# EAGLE design juggling_ballsch (EAGLE 6.5.0)
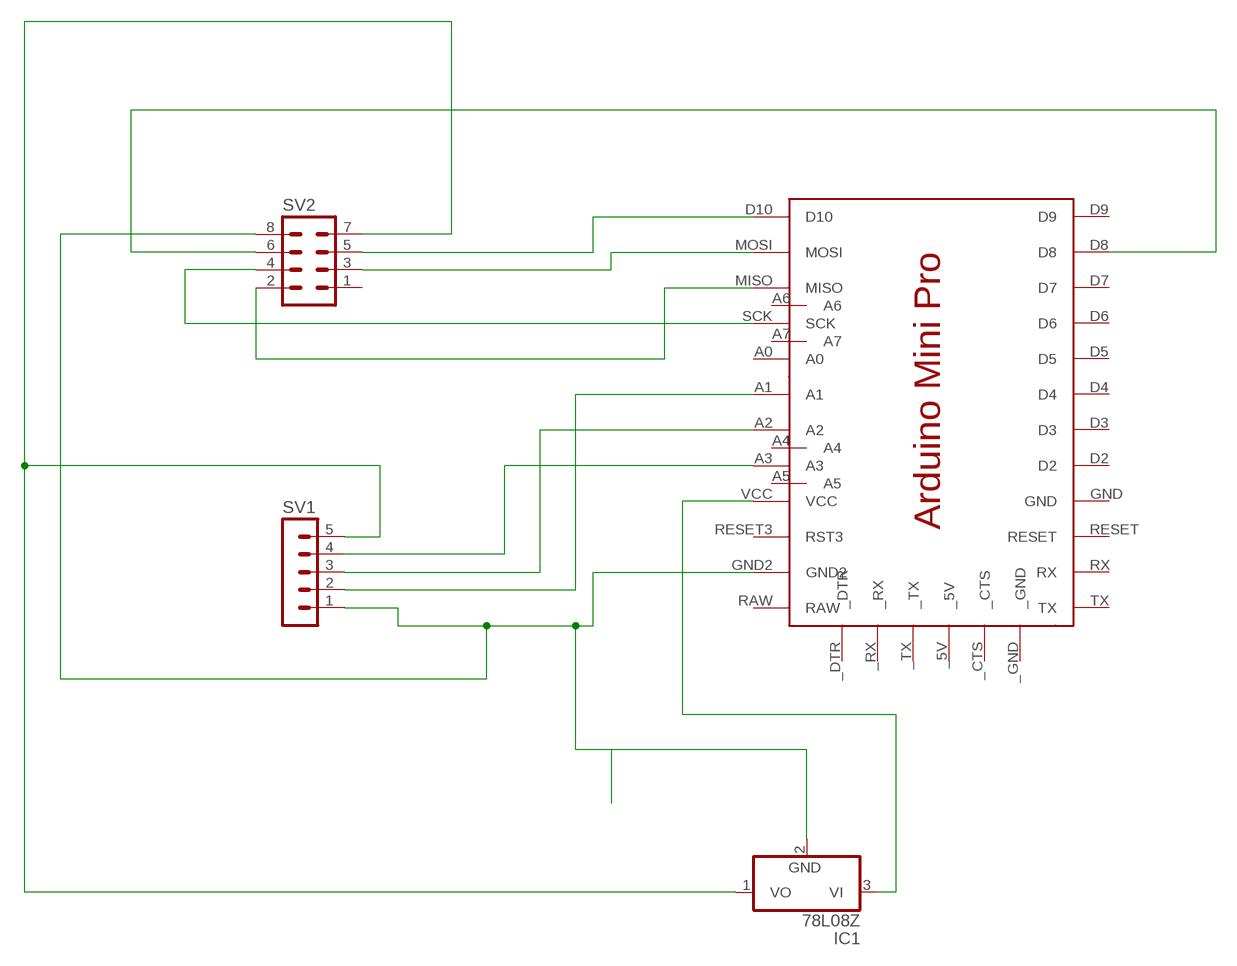
[diagram p0: schematic, sheet 1]

## Parts
IC1  78L08Z  [TO92]
SV1  MA05-1  [MA05-1]
SV2  MA04-2  [MA04-2]
U$1  ARDMINIPRO  [ARDMINIPRO]

## Nets
N$1: SV1.2 U$1.A1
N$2: SV1.3 U$1.A2
N$3: SV1.4 U$1.A3
N$4: IC1.2(GND) SV1.1 SV2.8 U$1.GND2
N$5: SV2.3 U$1.MOSI
N$6: SV2.5 U$1.D10
N$7: SV2.2 U$1.MISO
N$8: SV2.6 U$1.D8
N$9: SV2.4 U$1.SCK
N$11: IC1.1(VO) SV1.5 SV2.7
N$12: IC1.3(VI) U$1.VCC
Unconnected: SV2.1 U$1._5V U$1._CTS U$1._DTR U$1._GND U$1._RX U$1._TX U$1.A0 U$1.A4 U$1.A5 U$1.A6 U$1.A7 U$1.D2 U$1.D3 U$1.D4 U$1.D5 U$1.D6 U$1.D7 U$1.D9 U$1.GND U$1.RAW U$1.RESET U$1.RESET3(RST3) U$1.RX U$1.TX

## Library data of the parts
IC1 = adafruit:78*: Positive VOLTAGE REGULATOR Added bigger pads to the TO-92 package
SV1 = con-lstb:MA05-1: PIN HEADER; OC_FARNELL: unknown; OC_NEWARK: unknown
SV2 = con-lstb:MA04-2: PIN HEADER; OC_FARNELL: unknown; OC_NEWARK: unknown
U$1 = Charlie:ARDMINIPRO

## Board
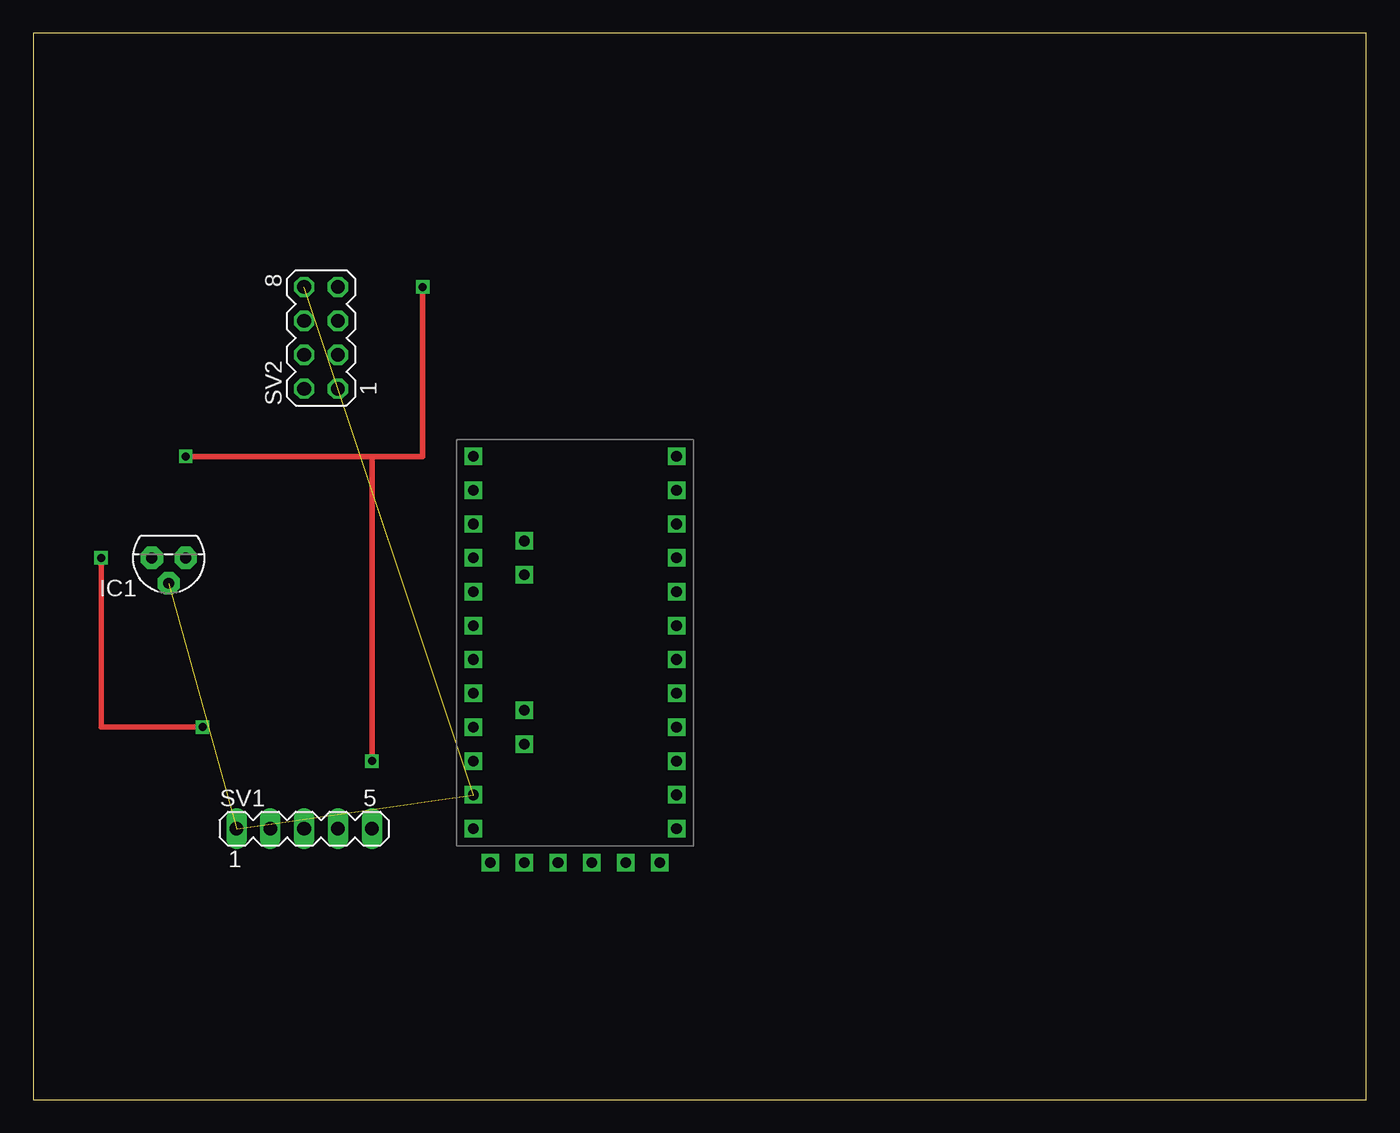
[diagram p1: board, top side]
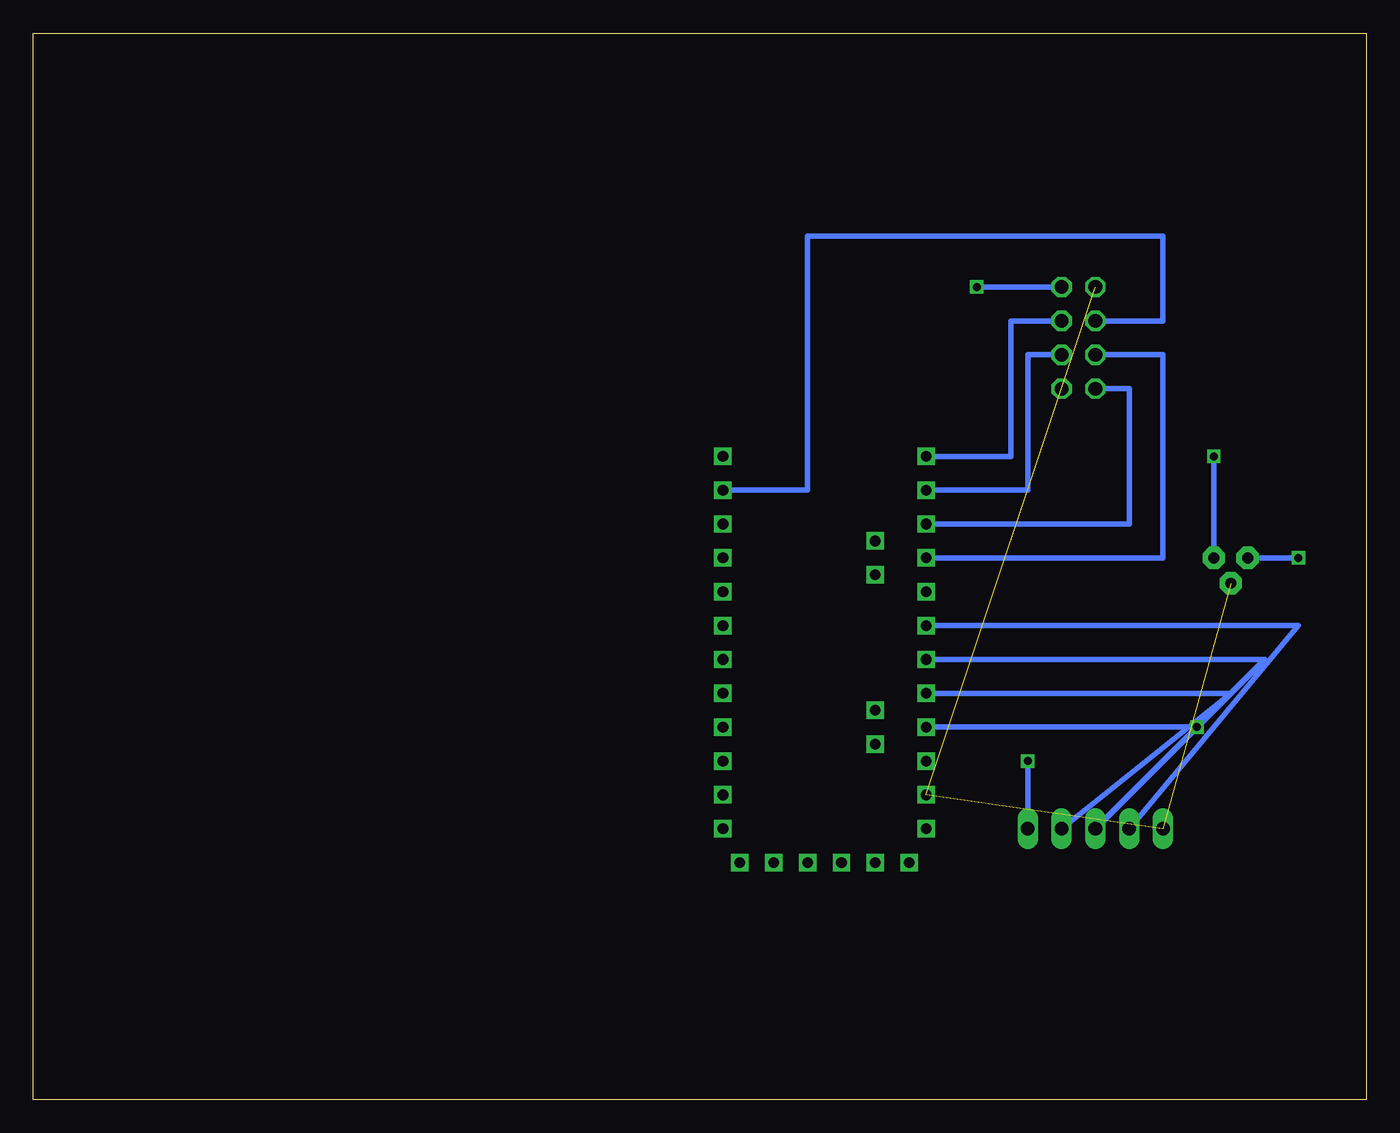
[diagram p2: board, bottom side, seen from below]

Size 100 x 80 mm. Coordinates in mm from the lower left corner, seen from the top.
Outline: 0,0 100,0 100,80 0,80 0,0
Copper layers (1*16): Top 0.035mm / dielectric 1.5mm / Bottom 0.035mm
Design rules "default": minimum track width 10mil, minimum drill 24mil, track to track 8mil, track to pad 8mil, pad to pad 8mil, via to via 8mil, smd to smd 8mil, copper to edge 40mil, drill to drill 8mil, minimum pad ring 10mil, minimum via ring 8mil, stop-mask expansion 4mil, vias tented up to drill 0mil, thermal gap 10mil

### Footprints (pad centres in the part's own frame; a part is rotated, then mirrored left to right if it is on the bottom)
TO92 = drill 0.813 pad 1.676 octagon: 1 -1.27,0; 2 0,1.905; 3 1.27,0
MA05-1 = drill 1.016 long: 1 -5.08,0; 2 -2.54,0; 3 0,0; 4 2.54,0; 5 5.08,0
MA04-2 = drill 1.016 octagon: 1 -3.81,-1.27; 2 -3.81,1.27; 3 -1.27,-1.27; 4 -1.27,1.27; 5 1.27,-1.27; 6 1.27,1.27; 7 3.81,-1.27; 8 3.81,1.27
ARDMINIPRO = drill 0.8 square: _5V -1.27,16.51; _CTS -3.81,16.51; _DTR 6.35,16.51; _GND -6.35,16.51; _RX 3.81,16.51; _TX 1.27,16.51; A0 7.62,-3.81; A1 7.62,-1.27; A2 7.62,1.27; A3 7.62,3.81; A4 3.81,5.08; A5 3.81,7.62; A6 3.81,-7.62; A7 3.81,-5.08; D2 -7.62,3.81; D3 -7.62,1.27; D4 -7.62,-1.27; D5 -7.62,-3.81; D6 -7.62,-6.35; D7 -7.62,-8.89; D8 -7.62,-11.43; D9 -7.62,-13.97; D10 7.62,-13.97; GND -7.62,6.35; GND2 7.62,11.43; MISO 7.62,-8.89; MOSI 7.62,-11.43; RAW 7.62,13.97; RESET -7.62,8.89; RESET3 7.62,8.89; RX -7.62,11.43; SCK 7.62,-6.35; TX -7.62,13.97; VCC 7.62,6.35

### Placement (x,y rotation side)
IC1  10.16,40.64 180 top
SV1  20.32,20.32 0 top
SV2  21.59,57.15 90 top
U$1  40.64,34.29 180 top

### Tracks (layer width: path | path; a pad name or v marks a point on that pad's centre or on a via)
N$1
  Bottom 0.406: SV1.2 5.08,35.56 U$1.A1
N$2
  Bottom 0.406: SV1.3 7.62,33.02 U$1.A2
N$3
  Bottom 0.406: SV1.4 10.16,30.48 U$1.A3
N$4  (3 unrouted)
N$5
  Bottom 0.406: SV2.3 25.4,55.88 25.4,45.72 U$1.MOSI
N$6
  Bottom 0.406: SV2.5 26.67,58.42 26.67,48.26 U$1.D10
N$7
  Bottom 0.406: SV2.2 17.78,53.34 17.78,43.18 U$1.MISO
N$8
  Bottom 0.406: SV2.6 15.24,58.42 15.24,64.77 41.91,64.77 41.91,45.72 U$1.D8
N$9
  Bottom 0.406: SV2.4 15.24,55.88 15.24,40.64 U$1.SCK
N$11  (via drill 0.6)
  Top 0.406: v11.43,48.26 25.4,48.26 | 25.4,48.26 29.21,48.26 v29.21,60.96 | v25.4,25.4 25.4,48.26
  Bottom 0.406: IC1.1 v11.43,48.26 | v29.21,60.96 SV2.7 | SV1.5 v25.4,25.4
  other vias: 25.4,20.32
N$12  (via drill 0.6)
  Top 0.406: v5.08,40.64 5.08,27.94 v12.7,27.94
  Bottom 0.406: IC1.3 v5.08,40.64 | v12.7,27.94 U$1.VCC